# EasyEDA Pro project 小张FOC-STM32G431CBU6.epro, schematic 驱动板
Create Date: 2024-04-24; Page Name: P1; Project Name: 小张FOC-STM32G431CBU6; Schematic Name: 驱动板; Update Date: 2024-09-16
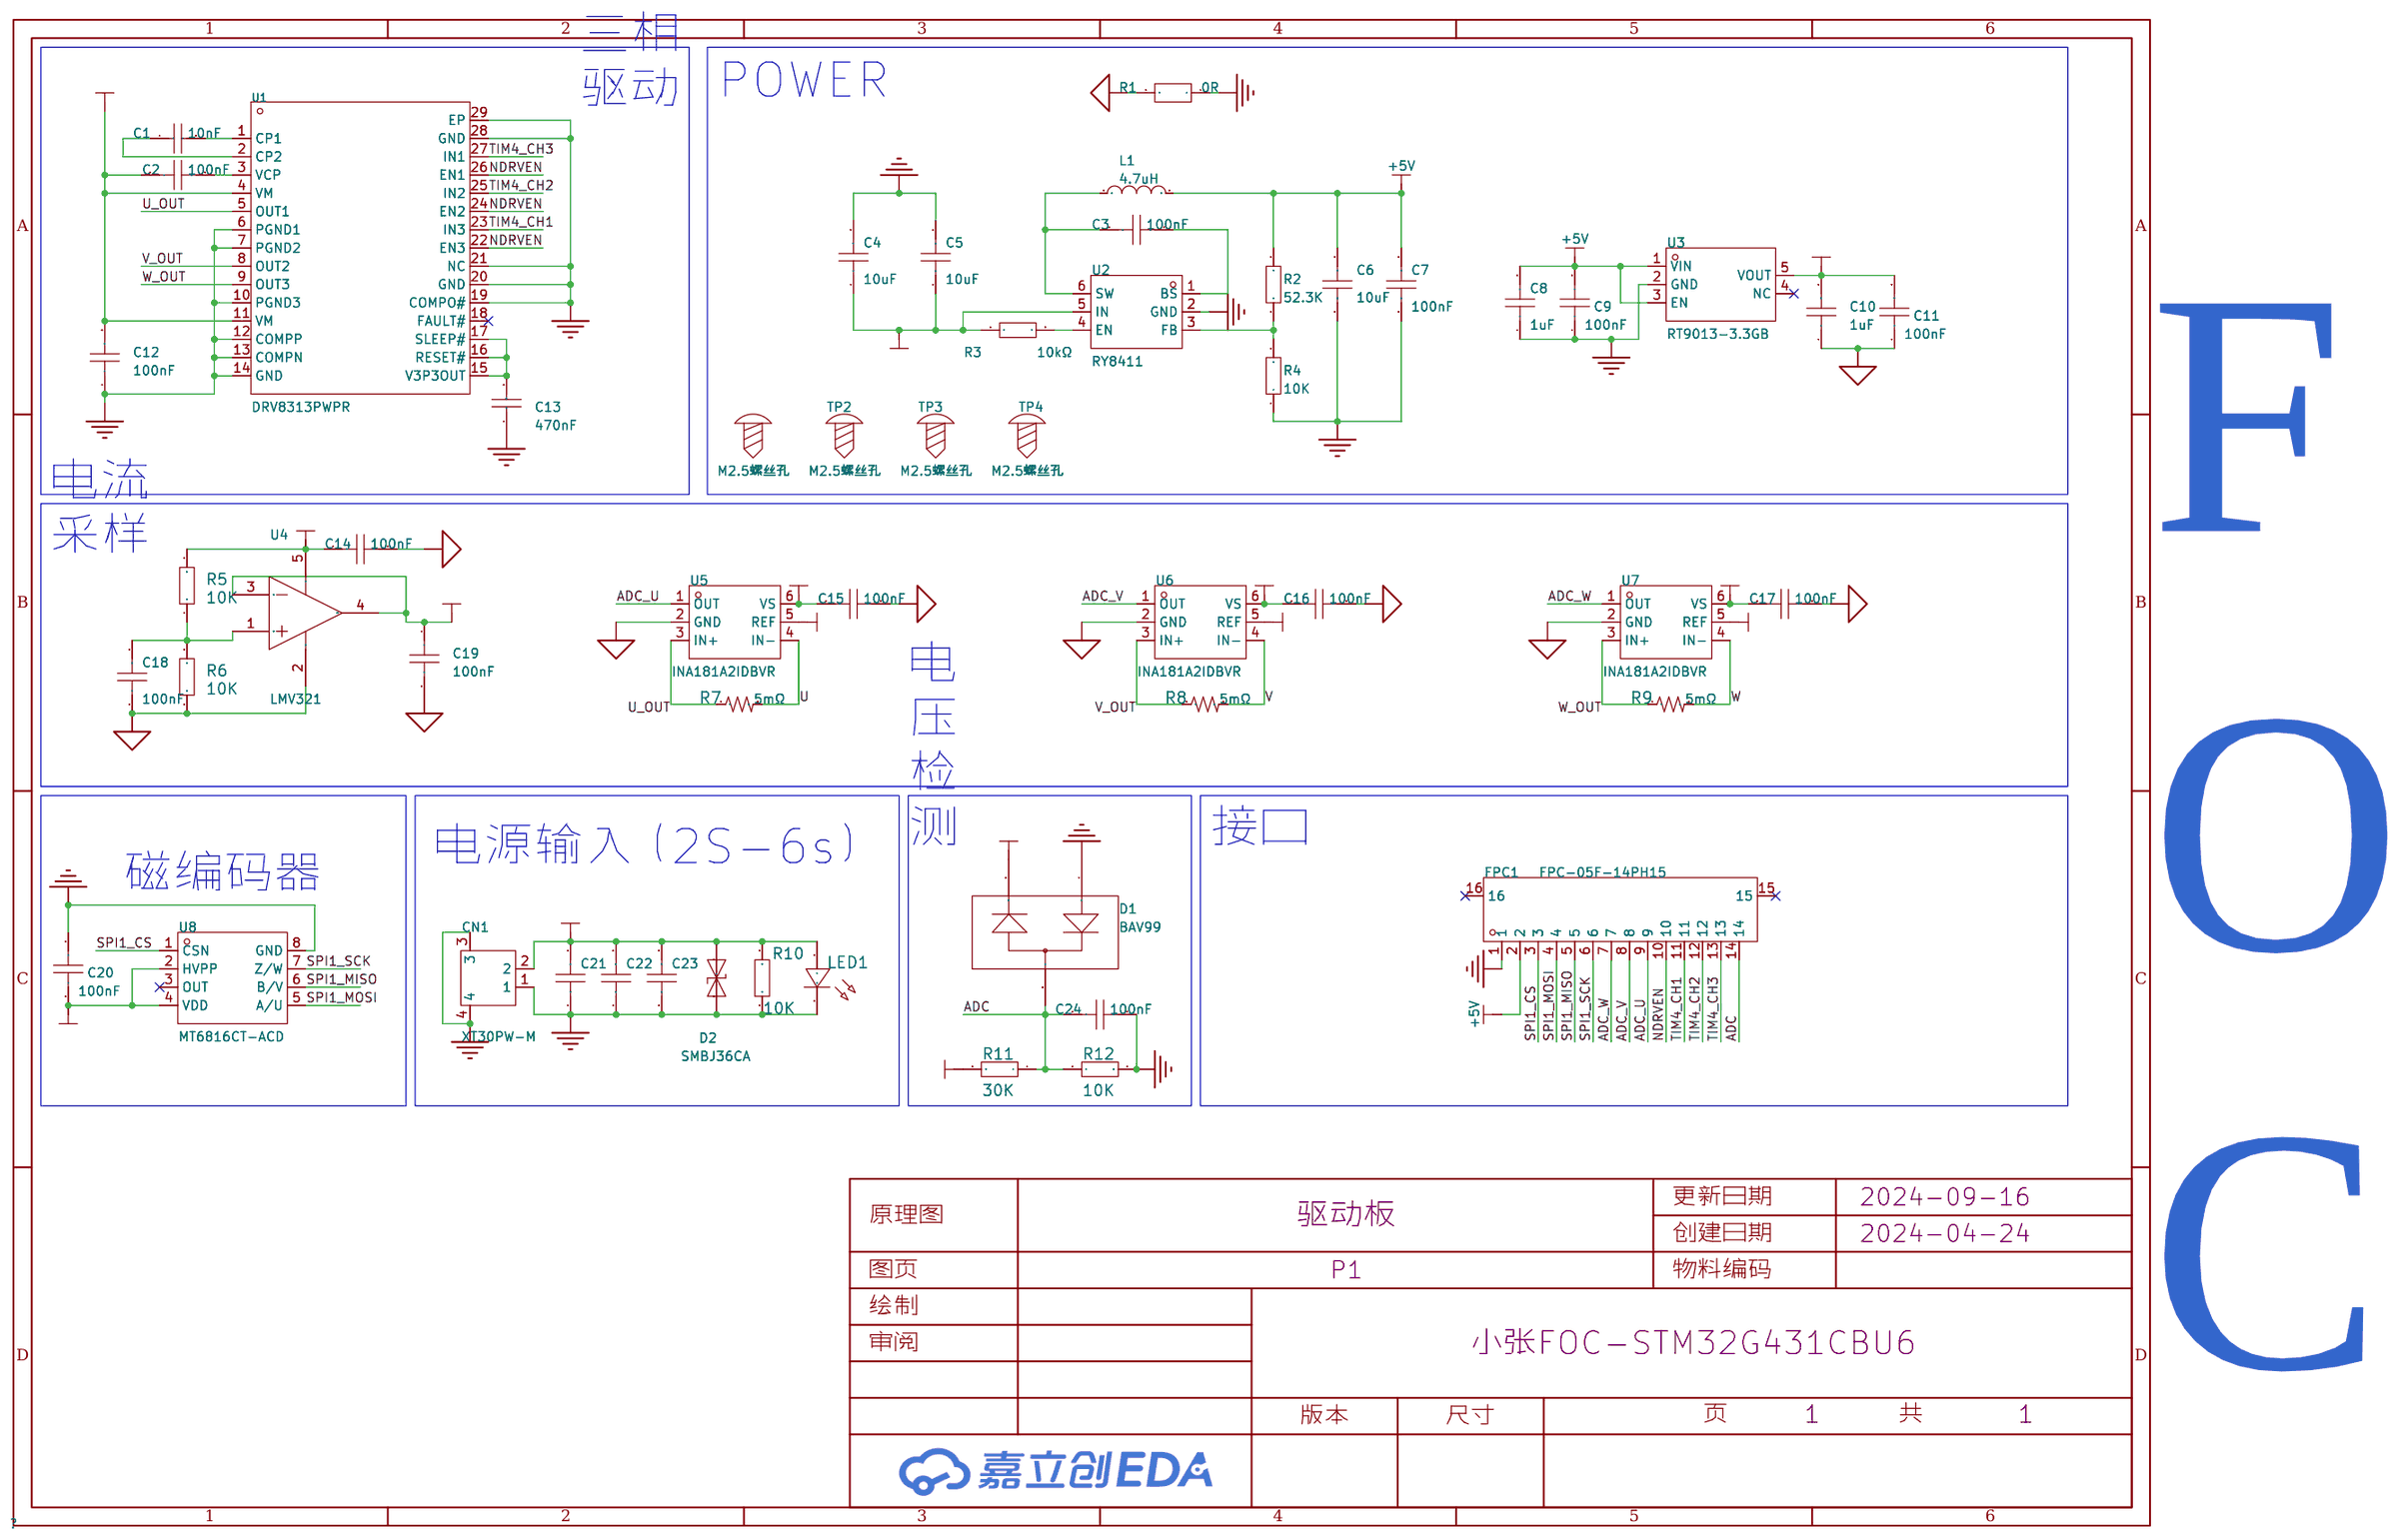
[diagram p1: schematic sheet]

## Parts
C1  10nF  [C0603_SMALL]
C2  100nF  [C0603_SMALL]
C3  100nF  [C0603_SMALL]
C4  10uF  [C0603_SMALL]
C5  10uF  [C0603_SMALL]
C6  10uF  [C0603_SMALL]
C7  100nF  [C0603_SMALL]
C8  1uF  [C0603_SMALL]
C9  100nF  [C0603_SMALL]
C10  1uF  [C0603_SMALL]
C11  100nF  [C0603_SMALL]
C12  100nF  [C0603_SMALL]
C13  470nF  [C0603_SMALL]
C14  100nF  [C0603_SMALL]
C15  100nF  [C0603_SMALL]
C16  100nF  [C0603_SMALL]
C17  100nF  [C0603_SMALL]
C18  100nF  [C0603_SMALL]
C19  100nF  [C0603_SMALL]
C20  100nF  [C0603_SMALL]
C21  22uF  [C1206_SMALL]
C22  22uF  [C1206_SMALL]
C23  22uF  [C1206_SMALL]
C24  100nF  [C0603_SMALL]
CN1  XT30PW-M  [CONN-TH_XT30PW-M]
D1  BAV99  [SOT-23-3_L2.9-W1.3-P1.90-LS2.4-BR]
D2  SMBJ36CA  [SMB_L4.6-W3.6-LS5.3-BI]
FPC1  FPC-05F-14PH15  [FPC-SMD_14P-P0.50_XUNPU_FPC-05F-14PH15]
L1  4.7uH  [IND-SMD_L4.5-W4.0-1]
LED1  -  [LED0603_RED_SMALL]
R1  0Ω  [R0603_SMALL]
R2  52.3K  [R0603_SMALL]
R3  10kΩ  [R0603_SMALL]
R4  10K  [R0603_SMALL]
R5  10K  [R0603_SMALL]
R6  10K  [R0603_SMALL]
R7  5mΩ  [R1206_SMALL]
R8  5mΩ  [R1206_SMALL]
R9  5mΩ  [R1206_SMALL]
R10  10K  [R0603_SMALL]
R11  30K  [R0603_SMALL]
R12  10K  [R0603_SMALL]
TP2  M2.5螺丝孔  [X-M2.5螺丝孔]
TP3  M2.5螺丝孔  [X-M2.5螺丝孔]
TP4  M2.5螺丝孔  [X-M2.5螺丝孔]
U1  DRV8313PWPR  [HTSSOP-28_L9.8-W4.5-P0.65-LS6.6-BL-EP]
U2  RY8411  [SOT-23-6_L2.9-W1.6-P0.95-LS2.8-TL]
U3  RT9013-3.3GB  [SOT-23-5_L2.9-W1.6-P0.94-LS2.8-BL]
U4  LMV321  [SOT-23-5_L3.0-W1.7-P0.95-LS2.8-BR]
U5  INA181A2IDBVR  [SOT-23-6_L2.9-W1.6-P0.95-LS2.8-BL]
U6  INA181A2IDBVR  [SOT-23-6_L2.9-W1.6-P0.95-LS2.8-BL]
U7  INA181A2IDBVR  [SOT-23-6_L2.9-W1.6-P0.95-LS2.8-BL]
U8  MT6816CT-ACD  [SOP-8_L5.0-W4.0-P1.27-LS6.0-BL]

## Library data of the parts
C1 = 0603B103K500NT: 容值:10nF;精度:±10%;额定电压:50V;材质(温度系数):X7R;; LCSC Part Name: 10nF ±10% 50V; Supplier Part: C57112; Manufacturer: FH(风华); Supplier Footprint: 0603; JLCPCB Part Class: 基础库; Datasheet: https://atta.szlcsc.com/upload/public/pdf/source/20200305/C486355_26A10D38EF8C2A5C37091D0039909270.pdf; Supplier: LCSC; Tolerance: ±10%; Voltage Rated: 50V; Temperature Coefficient: X7R
C2 C3 C7 C12 C14-C20 C24 = 0603B104K500NT: 容值:100nF;精度:±10%;额定电压:50V;材质(温度系数):X7R;; LCSC Part Name: 100nF ±10% 50V; Supplier Part: C30926; Manufacturer: FH(风华); Supplier Footprint: 0603; JLCPCB Part Class: Extended Part; Datasheet: https://atta.szlcsc.com/upload/public/pdf/source/20200305/C486355_26A10D38EF8C2A5C37091D0039909270.pdf; Supplier: LCSC; Tolerance: ±10%; Voltage Rated: 50V; Temperature Coefficient: X7R
C4-C6 = CL10A106MA8NRNC: 容值:10uF;精度:±20%;额定电压:25V;材质(温度系数):X5R;; LCSC Part Name: 10uF ±20% 25V; Supplier Part: C96446; Manufacturer: SAMSUNG(三星); Supplier Footprint: 0603; JLCPCB Part Class: 基础库; Datasheet: https://atta.szlcsc.com/upload/public/pdf/source/20160218/1457707763339.pdf; Supplier: LCSC; Tolerance: ±20%; Voltage Rated: 25V; Temperature Coefficient: X5R
C8 C10 = CL10A105KB8NNNC: 容值:1uF;精度:±10%;额定电压:50V;材质(温度系数):X5R;; LCSC Part Name: 1uF ±10% 50V; Supplier Part: C15849; Manufacturer: SAMSUNG(三星); Supplier Footprint: 0603; JLCPCB Part Class: 基础库; Datasheet: https://atta.szlcsc.com/upload/public/pdf/source/20160218/1457707763339.pdf; Supplier: LCSC; Tolerance: ±10%; Voltage Rated: 50V; Temperature Coefficient: X5R
C9 C11 = CC0603KRX7R9BB104: 容值:100nF;精度:±10%;额定电压:50V;材质(温度系数):X7R;; LCSC Part Name: 100nF ±10% 50V; Supplier Part: C14663; Manufacturer: YAGEO(国巨); Supplier Footprint: 0603; JLCPCB Part Class: 基础库; Datasheet: https://atta.szlcsc.com/upload/public/pdf/source/20180910/C282072_33301C7F631E79921B82A8DAC6BCC5B3.pdf; Supplier: LCSC; Tolerance: ±10%; Voltage Rated: 50V; Temperature Coefficient: X7R
C13 = CL10B474KA8NNNC: 容值:470nF;精度:±10%;额定电压:25V;材质(温度系数):X7R;; LCSC Part Name: 470nF ±10% 25V; Supplier Part: C1623; Manufacturer: SAMSUNG(三星); Supplier Footprint: 0603; Datasheet: https://atta.szlcsc.com/upload/public/pdf/source/20160218/1457707763339.pdf; Supplier: LCSC; Tolerance: ±10%; Voltage Rated: 25V; Temperature Coefficient: X7R
C21-C23 = CL32B226KAJNNNE: 容值:22uF;精度:±10%;额定电压:25V;温度系数:X7R;; LCSC Part Name: 22uF ±10% 25V; Supplier Part: C309062; Manufacturer: SAMSUNG(三星); LCSC On Sale: 1; Supplier Footprint: 1210; JLCPCB Part Class: 扩展库; JLCPCB On Sale: 1; Datasheet: https://atta.szlcsc.com/upload/public/pdf/source/20180928/C309062_204F2E6697A924E0F586375AE8E3E2E2.pdf; Supplier: LCSC; Tolerance: ±10%; Voltage Rated: 25V; Temperature Coefficient: X7R
CN1 = XT30PW-M: 类别:-;类型1:-;; LCSC Part Name: AMASS(艾迈斯)航模插头 卧式弯脚 XT30PW-M公头; Supplier Part: C431092; Manufacturer: AMASS(艾迈斯); JLCPCB Part Class: 扩展库; Datasheet: https://atta.szlcsc.com/upload/public/pdf/source/20220222/6A9F22F7850E25B33E1BE430ADF8560B.pdf; Supplier: LCSC; Brand: 艾迈斯; Type: 航模插头; RatedVoltage: DC 500V; InterfaceType: 公头; RatedCurrent: 15A; RecommendedWireGauge: 16/18/20AWG; contact resistance: 1.2mΩ; specifications: 2pin
D1 = BAV99: 二极管配置:1对串联式;正向压降(Vf):1.25V@150mA;直流反向耐压(Vr):70V;平均整流电流(Io):200mA;功率:225mW;反向恢复时间(trr):6ns;; LCSC Part Name: 电压:70V 电流:200mA; Supplier Part: C2990827; Manufacturer: GOOD-ARK(固锝); Supplier Footprint: SOT-23; JLCPCB Part Class: 扩展库; Datasheet: https://atta.szlcsc.com/upload/public/pdf/source/20220413/22A2A9FA2D144A988819B9B151069B7B.pdf; Supplier: LCSC; Diode Configuration: 1对串联式; Forward Voltage (Vf@If): 1.25V@150mA; Reverse Voltage (Vr): 70V; Average Rectified Current (Io): 200mA; Power Dissipation: 225mW; Reverse Leakage Current: 2.5uA@70V; Reverse Recovery Time (trr): 6ns; Operating Temperature: -55℃~+150℃@(Tj)
D2 = SMBJ36CA: 反向截止电压(Vrwm):36V;最大钳位电压:58.1V;峰值脉冲电流(Ipp)@10/1000us:10.4A;击穿电压:40V;; Supplier Part: C294913; Manufacturer: SEMIWARE(赛米微尔); Supplier Footprint: SMB; Datasheet: https://atta.szlcsc.com/upload/public/pdf/source/20181106/C328047_FD4931DA26109CA76B39364EA3BDC1D8.pdf; Supplier: LCSC; Reverse Stand-Off Voltage (Vrwm): 36V; Maximum Clamping Voltage: 58.1V; Peak Pulse Current (Ipp)@10/1000us: 10.4A; Breakdown Voltage: 40V; Reverse Leakage Current (Ir): 1uA; Type: TVS
FPC1 = FPC-05F-14PH15: 锁定特性:翻盖式;触点类型:下接;触点数量:14P;间距:0.5mm;安装类型:卧贴;工作温度范围:-25℃~+85℃;; LCSC Part Name: 间距:0.5mm P数:14P 翻盖式 下接; Supplier Part: C2856818; Manufacturer: XUNPU(讯普); Supplier Footprint: SMD,P=0.5mm,卧贴; JLCPCB Part Class: 扩展库; Datasheet: https://atta.szlcsc.com/upload/public/pdf/source/20210922/C2856818_BF9A09706769A6AB1B749235C5052B10.pdf; Supplier: LCSC; Locking Feature: 翻盖式; Contact Type: 下接; Number of Contacts: 14P; Pitch: 0.5mm; Mounting Type: 卧贴; FFC, FCB Thickness: 0.3mm; Height Above Board: 1.5mm; Operating Temperature Range: -25℃~+85℃
L1 = MCS0420-4R7MPN2: 电感值:4.7uH;精度:±20%;额定电流:2.2A;饱和电流(Isat):3.5A;; LCSC Part Name: 4.7uH ±20% 2.2A 98mΩ; Supplier Part: C2937092; Manufacturer: PSA(信昌电陶); Supplier Footprint: 0420; JLCPCB Part Class: Extended Part; Datasheet: https://atta.szlcsc.com/upload/public/pdf/source/20220121/BD01ABADD177E465ADC6F87339B1CE90.pdf; Supplier: LCSC; Tolerance: ±20%; Rated Current: 2.2A; Saturation Current (Isat): 3.5A; DC Resistance (DCR): 98mΩ
LED1 = LED_0603-R: Supplier Footprint: 0603
R1 = CR0603F0R00P05Z: 阻值:0Ω;精度:±1%;功率:1/10W;温度系数:-;; LCSC Part Name: 0Ω ±1%; Supplier Part: C881308; Manufacturer: EVER OHMS(天二科技); Supplier Footprint: 0603; JLCPCB Part Class: 扩展库; Datasheet: https://atta.szlcsc.com/upload/public/pdf/source/20201014/C881429_ABC29D63C8D6A11EB63D87348B25AA7B.pdf; Supplier: LCSC; Tolerance: ±1%; Power(Watts): 1/10W
R2 R4 = Res_0603: Supplier Footprint: 0603
R3 = 0603WAF1002T5E: 阻值:10kΩ;精度:±1%;功率:100mW;温度系数:±100ppm/℃;电阻类型:厚膜电阻;; LCSC Part Name: 10kΩ ±1% 100mW 厚膜电阻; Supplier Part: C25804; Manufacturer: UNI-ROYAL(厚声); Supplier Footprint: 0603; JLCPCB Part Class: Basic Part; Datasheet: https://atta.szlcsc.com/upload/public/pdf/source/20200306/C422600_1E6D84923E4A46A82E41ADD87F860B5C.pdf; Supplier: LCSC; Tolerance: ±1%; Power(Watts): 100mW; Overload Voltage (Max): 75V; Temperature Coefficient: ±100ppm/℃; Type: 厚膜电阻; Operating Temperature Range: -55℃~+155℃
R5 R6 R10-R12 = 10K: 3DModel: R0603; link: https://www.mouser.in/datasheet/2/447/PYu_RT_1_to_0_01_RoHS_L_11-1669912.pdf; Supplier: LCSC; Supplier Part: C2976753; Manufacturer: FH(风华); Manufacturer Part: CMFA103J3600HANT; JLCPCB Part Class: Extended Part
R7-R9 = 5mΩ/R1206: 阻值（欧姆）:0.005Ω;精度:±1%;功率:1W;温度系数:±100ppm/°C;; Supplier Part: C473541; Manufacturer: UNI-ROYAL(厚声); Manufacturer Part: MS061WF500NT5E; LCSC On Sale: 1; Supplier Footprint: 1206; JLCPCB Part Class: 扩展库; JLCPCB Stock Number: 0; Datasheet: https://atta.szlcsc.com/upload/public/pdf/source/20191223/C473541_9C9FA6CFA39D9EEFF1D6C941750AFB9D.pdf; Supplier: LCSC; Tolerance: ±1%; Temperature Coefficient: ±100ppm/°C; 功率: 1W
TP2-TP4 = X-M2.5螺丝孔: _: 3
U1 = DRV8313PWPR: 驱动电机类型:无刷直流BLDC;电源电压:8V~60V;输出电流:-;接口:并行;; LCSC Part Name: 无刷直流BLDC电机驱动芯片 60V; Supplier Part: C92482; Manufacturer: TI(德州仪器); Supplier Footprint: HTSSOP-28-EP-4.5mm; JLCPCB Part Class: 扩展库; Datasheet: https://www.ti.com/cn/lit/gpn/drv8313; Supplier: LCSC; Drive motor type: 无刷直流BLDC; Supply Voltage: 8V~60V; Interface: 并行; Operating Temperature: -40℃~+150℃@(Tj)
U2 = RY8411_C2935411: Supplier Part: C2935411; Manufacturer: RYCHiP(蕊源); Supplier Footprint: SOT-23-6; JLCPCB Part Class: Extended Part; Datasheet: https://atta.szlcsc.com/upload/public/pdf/source/20211220/DB2E518D79CF9F576C855DA4549CDE87.pdf; Supplier: LCSC
U3 = RT9013-3.3GB: Supplier Part: C9900009203; Supplier Footprint: SOT-23-5; JLCPCB Part Class: 扩展库; Supplier: LCSC
U4 = LMV321: 增益带宽积(GBP):1MHz;压摆率(SR):0.4V/us;; Supplier Part: C2904381; Manufacturer: Slkor(萨科微); Supplier Footprint: SOT-23-5; JLCPCB Part Class: 扩展库; Datasheet: https://atta.szlcsc.com/upload/public/pdf/source/20211008/F7FE51BBE778A8191EAE612DAA5D60E0.pdf; Supplier: LCSC; Gain Bandwidth Product(GBP): 1MHz; Common Mode Rejection Ratio (CMRR): 85dB; Slew Rate(SR): 0.4V/us
U5-U7 = INA181A2IDBVR: 放大器数:单路;; Supplier Part: C2058784; Manufacturer: TI(德州仪器); Supplier Footprint: SOT-23-6; JLCPCB Part Class: 扩展库; Datasheet: https://www.ti.com/cn/lit/gpn/ina2181; Supplier: LCSC; Number of Channels: 单路; Supply Current: 260uA; Operating Temperature: -40℃~+125℃
U8 = MT6816CT-ACD: AB=1024线，Z=4LSB，PWM=1KHz; LCSC Part Name: 零延迟磁角位置传感器IC; Supplier Part: C879560; Manufacturer: MagnTek(麦歌恩); Supplier Footprint: SOP-8; JLCPCB Part Class: 扩展库; Datasheet: https://atta.szlcsc.com/upload/public/pdf/source/20201027/C879560_21F27A21E71569DDEA564795613A647F.pdf; Supplier: LCSC

## Nets
1V65: C19.1 U4.3(IN-) U4.4(OUT) U5.5(REF) U6.5(REF) U7.5(REF)
+5V: C6.2 C7.2 C8.2 C9.2 FPC1.2 L1.2 R2.2 U3.1(VIN) U3.3(EN)
AGND: C10.1 C11.1 C14.2 C15.2 C16.2 C17.2 C18.2 C19.2 R1.2 R6.1 U4.2(GND) U5.2(GND) U6.2(GND) U7.2(GND)
AVCC: C10.2 C11.2 C14.1 C15.1 C16.1 C17.1 C20.2 D1.2 R5.2 U3.5(VOUT) U4.5(VCC+) U5.6(VS) U6.6(VS) U7.6(VS) U8.2(HVPP) U8.4(VDD)
GND: C4.2 C5.2 C6.1 C7.1 C8.1 C9.1 C12.1 C13.1 C20.1 C21.1 C22.1 C23.1 C24.2 CN1.1 CN1.3 CN1.4 D1.1 D2.2(A) FPC1.1 LED1.1(C) R1.1 R4.1 R10.1 R12.2 U1.6(PGND1) U1.7(PGND2) U1.10(PGND3) U1.12(COMPP) U1.13(COMPN) U1.14(GND) U1.19(COMPO#) U1.20(GND) U1.21(NC) U1.28(GND) U1.29(EP) U2.2(GND) U3.2(GND) U8.8(GND)
ADC: C24.1 D1.3 FPC1.14 R11.1 R12.1
ADC_U: FPC1.9 U5.1(OUT)
ADC_V: FPC1.8 U6.1(OUT)
ADC_W: FPC1.7 U7.1(OUT)
DCBUS: C2.1 C4.1 C5.1 C12.2 C21.2 C22.2 C23.2 CN1.2 D2.1(K) LED1.2(A) R3.1 R10.2 R11.2 U1.4(VM) U1.11(VM) U2.5(IN)
NDRVEN: FPC1.10 U1.22(EN3) U1.24(EN2) U1.26(EN1)
SPI1_CS: FPC1.3 U8.1(CSN)
SPI1_MISO: FPC1.5 U8.6(B/V)
SPI1_MOSI: FPC1.4 U8.5(A/U)
SPI1_SCK: FPC1.6 U8.7(Z/W)
TIM4_CH1: FPC1.11 U1.23(IN3)
TIM4_CH2: FPC1.12 U1.25(IN2)
TIM4_CH3: FPC1.13 U1.27(IN1)
U: R7.2 U5.4(IN-)
U_OUT: R7.1 U1.5(OUT1) U5.3(IN+)
V: R8.2 U6.4(IN-)
V_OUT: R8.1 U1.8(OUT2) U6.3(IN+)
W: R9.2 U7.4(IN-)
W_OUT: R9.1 U1.9(OUT3) U7.3(IN+)
$1N335: C1.2 U1.1(CP1)
$1N336: C1.1 U1.2(CP2)
$1N337: C2.2 U1.3(VCP)
$1N347: C13.2 U1.15(V3P3OUT) U1.16(RESET#) U1.17(SLEEP#)
$1N1342: R3.2 U2.4(EN)
$1N1348: C3.1 U2.1(BS)
$1N1349: C3.2 L1.1 U2.6(SW)
$1N1350: R2.1 R4.2 U2.3(FB)
$1N7698: C18.1 R5.1 R6.2 U4.1(IN+)

Not connected (* = marked no-connect by the designer): FPC1 15* 16*; U1 18(FAULT#)*; U3 4(NC)*; U8 3(OUT)*

## Notes on the sheet
- POWER
- 三相
  驱动
- F
  O
  C
- 电流
  采样
- 电
  压
  检
  测
- 接口
- 电源输入（2S-6s）
- 磁编码器
